# Altium schematic sheet DUT_STM32H753VIT6.SchDoc
size A4; SheetNumber: 1; SheetTotal: 1
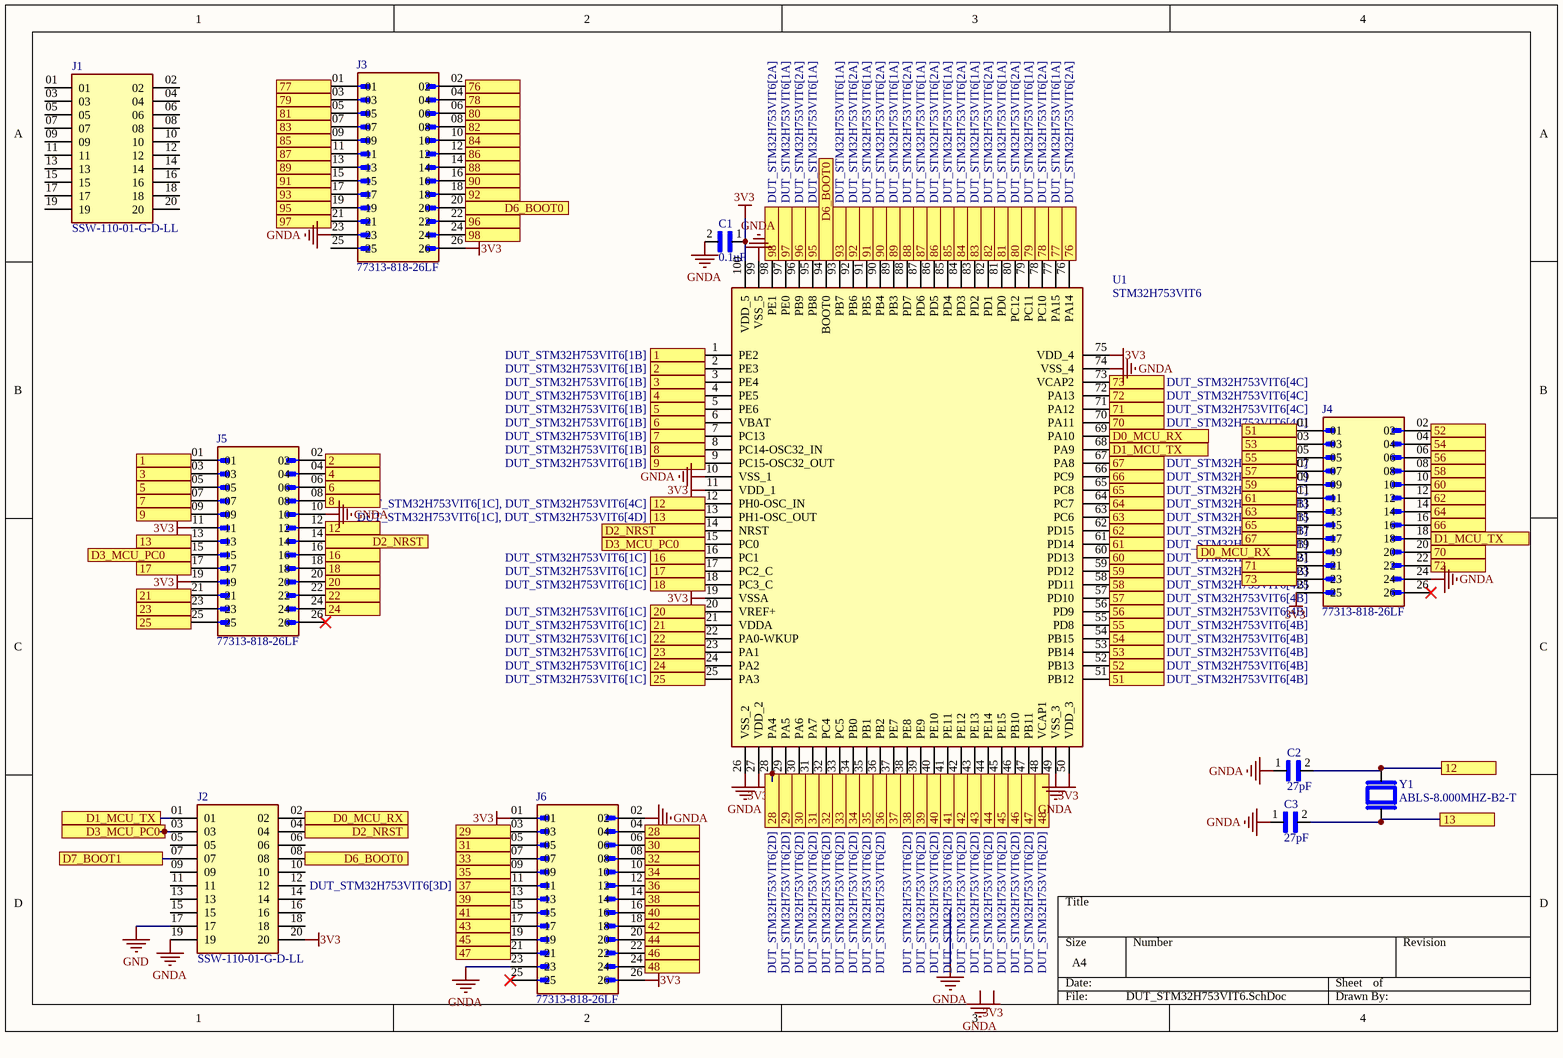
[diagram p0: DUT_STM32H753VIT6.SchDoc]

## Parts
C1  0.1uF  [CAPC1608X90]
C2  27pF  [CAPC1608X90]
C3  27pF  [CAPC1608X90]
J1  SSW-110-01-G-D-LL  [SAMTEC_SSW-110-01-G-D-LL]
J2  SSW-110-01-G-D-LL  [SAMTEC_SSW-110-01-G-D-LL]
J3  77313-818-26LF  [AMPHENOL_77313-818-26LF]
J4  77313-818-26LF  [AMPHENOL_77313-818-26LF]
J5  77313-818-26LF  [AMPHENOL_77313-818-26LF]
J6  77313-818-26LF  [AMPHENOL_77313-818-26LF]
U1  STM32H753VIT6  [QFP50P1600X1600X160-100N]
Y1  ABLS-8.000MHZ-B2-T  [XTAL_ABLS-8.000MHZ-B2-T]

## Ports
1 (see DUT_STM32H753VIT6[1B]), 1 (see DUT_STM32H753VIT6[2B]), 2 (see DUT_STM32H753VIT6[1B]), 2 (see DUT_STM32H753VIT6[2B]), 3 (see DUT_STM32H753VIT6[1B]), 3 (see DUT_STM32H753VIT6[2B]), 4 (see DUT_STM32H753VIT6[1B]), 4 (see DUT_STM32H753VIT6[2B]), 5 (see DUT_STM32H753VIT6[1B]), 5 (see DUT_STM32H753VIT6[2B]), 6 (see DUT_STM32H753VIT6[1B]), 6 (see DUT_STM32H753VIT6[2B]), 7 (see DUT_STM32H753VIT6[1B]), 7 (see DUT_STM32H753VIT6[2B]), 8 (see DUT_STM32H753VIT6[1B]), 8 (see DUT_STM32H753VIT6[2B]), 9 (see DUT_STM32H753VIT6[1B]), 9 (see DUT_STM32H753VIT6[2B]), 12 (see DUT_STM32H753VIT6[1C], DUT_STM32H753VIT6[2B]), 12 (see DUT_STM32H753VIT6[1C], DUT_STM32H753VIT6[4C]), 12 (see DUT_STM32H753VIT6[2B], DUT_STM32H753VIT6[4C]), 13 (see DUT_STM32H753VIT6[1C], DUT_STM32H753VIT6[2B]), 13 (see DUT_STM32H753VIT6[1C], DUT_STM32H753VIT6[4D]), 13 (see DUT_STM32H753VIT6[2B], DUT_STM32H753VIT6[4D]), 16 (see DUT_STM32H753VIT6[1C]), 16 (see DUT_STM32H753VIT6[2C]), 17 (see DUT_STM32H753VIT6[1C]), 17 (see DUT_STM32H753VIT6[2C]), 18 (see DUT_STM32H753VIT6[1C]), 18 (see DUT_STM32H753VIT6[2C]), 20 (see DUT_STM32H753VIT6[1C]), 20 (see DUT_STM32H753VIT6[2C]), 21 (see DUT_STM32H753VIT6[1C]), 21 (see DUT_STM32H753VIT6[2C]), 22 (see DUT_STM32H753VIT6[1C]), 22 (see DUT_STM32H753VIT6[2C]), 23 (see DUT_STM32H753VIT6[1C]), 23 (see DUT_STM32H753VIT6[2C]), 24 (see DUT_STM32H753VIT6[1C]), 24 (see DUT_STM32H753VIT6[2C]), 25 (see DUT_STM32H753VIT6[1C]), 25 (see DUT_STM32H753VIT6[2C]), 28 (see DUT_STM32H753VIT6[2D]), 29 (see DUT_STM32H753VIT6[2D]), 29 (see DUT_STM32H753VIT6[3D]), 30 (see DUT_STM32H753VIT6[2D]), 30 (see DUT_STM32H753VIT6[3D]), 31 (see DUT_STM32H753VIT6[2D]), 31 (see DUT_STM32H753VIT6[3D]), 32 (see DUT_STM32H753VIT6[2D]), 32 (see DUT_STM32H753VIT6[3D]), 33 (see DUT_STM32H753VIT6[2D]), 33 (see DUT_STM32H753VIT6[3D]), 34 (see DUT_STM32H753VIT6[2D]), 34 (see DUT_STM32H753VIT6[3D]), 35 (see DUT_STM32H753VIT6[2D]), 35 (see DUT_STM32H753VIT6[3D]), 36 (see DUT_STM32H753VIT6[2D]), 36 (see DUT_STM32H753VIT6[3D]), 37 (see DUT_STM32H753VIT6[2D]), 37 (see DUT_STM32H753VIT6[3D]), 38 (see DUT_STM32H753VIT6[2D]), 38 (see DUT_STM32H753VIT6[3D]), 39 (see DUT_STM32H753VIT6[2D]), 39 (see DUT_STM32H753VIT6[3D]), 40 (see DUT_STM32H753VIT6[2D]), 40 (see DUT_STM32H753VIT6[3D]), 41 (see DUT_STM32H753VIT6[2D]), 41 (see DUT_STM32H753VIT6[3D]), 42 (see DUT_STM32H753VIT6[2D]), 42 (see DUT_STM32H753VIT6[3D]), 43 (see DUT_STM32H753VIT6[2D]), 43 (see DUT_STM32H753VIT6[3D]), 44 (see DUT_STM32H753VIT6[2D]), 44 (see DUT_STM32H753VIT6[3D]), 45 (see DUT_STM32H753VIT6[2D]), 45 (see DUT_STM32H753VIT6[3D]), 46 (see DUT_STM32H753VIT6[2D]), 46 (see DUT_STM32H753VIT6[3D]), 47 (see DUT_STM32H753VIT6[2D]), 47 (see DUT_STM32H753VIT6[3D]), 48 (see DUT_STM32H753VIT6[2D]), 48 (see DUT_STM32H753VIT6[3D]), 51 (see DUT_STM32H753VIT6[3C]), 51 (see DUT_STM32H753VIT6[4B]), 52 (see DUT_STM32H753VIT6[3C]), 52 (see DUT_STM32H753VIT6[4B]), 53 (see DUT_STM32H753VIT6[3C]), 53 (see DUT_STM32H753VIT6[4B]), 54 (see DUT_STM32H753VIT6[3C]), 54 (see DUT_STM32H753VIT6[4B]), 55 (see DUT_STM32H753VIT6[3C]), 55 (see DUT_STM32H753VIT6[4B]), 56 (see DUT_STM32H753VIT6[3C]), 56 (see DUT_STM32H753VIT6[4B]), 57 (see DUT_STM32H753VIT6[3C]), 57 (see DUT_STM32H753VIT6[4B]), 58 (see DUT_STM32H753VIT6[3C]), 58 (see DUT_STM32H753VIT6[4B]), 59 (see DUT_STM32H753VIT6[3C]), 59 (see DUT_STM32H753VIT6[4B]), 60 (see DUT_STM32H753VIT6[3C]), 60 (see DUT_STM32H753VIT6[4B]), 61 (see DUT_STM32H753VIT6[3C]), 61 (see DUT_STM32H753VIT6[4B]), 62 (see DUT_STM32H753VIT6[3C]), 62 (see DUT_STM32H753VIT6[4B]), 63 (see DUT_STM32H753VIT6[3B]), 63 (see DUT_STM32H753VIT6[4B]), 64 (see DUT_STM32H753VIT6[3B]), 64 (see DUT_STM32H753VIT6[4B]), 65 (see DUT_STM32H753VIT6[3B]), 65 (see DUT_STM32H753VIT6[4C]), 66 (see DUT_STM32H753VIT6[3B]), 66 (see DUT_STM32H753VIT6[4C]), 67 (see DUT_STM32H753VIT6[3B]), 67 (see DUT_STM32H753VIT6[4C]), 70 (see DUT_STM32H753VIT6[3B]), 70 (see DUT_STM32H753VIT6[4C]), 71 (see DUT_STM32H753VIT6[3B]), 71 (see DUT_STM32H753VIT6[4C]), 72 (see DUT_STM32H753VIT6[3B]), 72 (see DUT_STM32H753VIT6[4C]), 73 (see DUT_STM32H753VIT6[3B]), 73 (see DUT_STM32H753VIT6[4C]), 76 (see DUT_STM32H753VIT6[2A]), 76 (see DUT_STM32H753VIT6[3A]), 77 (see DUT_STM32H753VIT6[1A]), 77 (see DUT_STM32H753VIT6[3A]), 78 (see DUT_STM32H753VIT6[2A]), 78 (see DUT_STM32H753VIT6[3A]), 79 (see DUT_STM32H753VIT6[1A]), 79 (see DUT_STM32H753VIT6[3A]), 80 (see DUT_STM32H753VIT6[2A]), 80 (see DUT_STM32H753VIT6[3A]), 81 (see DUT_STM32H753VIT6[1A]), 81 (see DUT_STM32H753VIT6[3A]), 82 (see DUT_STM32H753VIT6[2A]), 82 (see DUT_STM32H753VIT6[3A]), 83 (see DUT_STM32H753VIT6[1A]), 83 (see DUT_STM32H753VIT6[3A]), 84 (see DUT_STM32H753VIT6[2A]), 84 (see DUT_STM32H753VIT6[3A]), 85 (see DUT_STM32H753VIT6[1A]), 85 (see DUT_STM32H753VIT6[3A]), 86 (see DUT_STM32H753VIT6[2A]), 86 (see DUT_STM32H753VIT6[3A]), 87 (see DUT_STM32H753VIT6[1A]), 87 (see DUT_STM32H753VIT6[3A]), 88 (see DUT_STM32H753VIT6[2A]), 88 (see DUT_STM32H753VIT6[3A]), 89 (see DUT_STM32H753VIT6[1A]), 89 (see DUT_STM32H753VIT6[3A]), 90 (see DUT_STM32H753VIT6[2A]), 90 (see DUT_STM32H753VIT6[3A]), 91 (see DUT_STM32H753VIT6[1A]), 91 (see DUT_STM32H753VIT6[3A]), 92 (see DUT_STM32H753VIT6[2A]), 92 (see DUT_STM32H753VIT6[3A]), 93 (see DUT_STM32H753VIT6[1A]), 93 (see DUT_STM32H753VIT6[3A]), 95 (see DUT_STM32H753VIT6[1A]), 95 (see DUT_STM32H753VIT6[3A]), 96 (see DUT_STM32H753VIT6[2A]), 96 (see DUT_STM32H753VIT6[3A]), 97 (see DUT_STM32H753VIT6[1A]), 97 (see DUT_STM32H753VIT6[3A]), 98 (see DUT_STM32H753VIT6[2A]), D0_MCU_RX (see DUT_STM32H753VIT6[1D], DUT_STM32H753VIT6[3B]), D0_MCU_RX (see DUT_STM32H753VIT6[1D], DUT_STM32H753VIT6[4C]), D0_MCU_RX (see DUT_STM32H753VIT6[3B], DUT_STM32H753VIT6[4C]), D1_MCU_TX (see DUT_STM32H753VIT6[1D], DUT_STM32H753VIT6[3B]), D1_MCU_TX (see DUT_STM32H753VIT6[1D], DUT_STM32H753VIT6[4C]), D1_MCU_TX (see DUT_STM32H753VIT6[3B], DUT_STM32H753VIT6[4C]), D2_NRST (see DUT_STM32H753VIT6[1C], DUT_STM32H753VIT6[1D]), D2_NRST (see DUT_STM32H753VIT6[1C], DUT_STM32H753VIT6[2C]), D2_NRST (see DUT_STM32H753VIT6[1D], DUT_STM32H753VIT6[2C]), D3_MCU_PC0 (see DUT_STM32H753VIT6[1C], DUT_STM32H753VIT6[1D]), D3_MCU_PC0 (see DUT_STM32H753VIT6[1C], DUT_STM32H753VIT6[2C]), D3_MCU_PC0 (see DUT_STM32H753VIT6[1D], DUT_STM32H753VIT6[2C]), D6_BOOT0 (see DUT_STM32H753VIT6[1D], DUT_STM32H753VIT6[2A]), D6_BOOT0 (see DUT_STM32H753VIT6[1D], DUT_STM32H753VIT6[3A]), D6_BOOT0 (see DUT_STM32H753VIT6[2A], DUT_STM32H753VIT6[3A]), D7_BOOT1

## Nets
3V3: C1.1 J2.20 J3.26 J4.25 J5.11 J5.19 J6.01 J6.26 U1.11(VDD_1) U1.19(VSSA) U1.27(VDD_2) U1.50(VDD_3) U1.75(VDD_4) U1.100(VDD_5)
GND: J2.17
GNDA: C1.2 C2.1 C3.1 J2.19 J3.23 J4.24 J5.10 J6.02 J6.23 U1.10(VSS_1) U1.26(VSS_2) U1.49(VSS_3) U1.74(VSS_4) U1.99(VSS_5)
1: J5.01 U1.1(PE2) ; port 1
2: J5.02 U1.2(PE3) ; port 2
3: J5.03 U1.3(PE4) ; port 3
4: J5.04 U1.4(PE5) ; port 4
5: J5.05 U1.5(PE6) ; port 5
6: J5.06 U1.6(VBAT) ; port 6
7: J5.07 U1.7(PC13) ; port 7
8: J5.08 U1.8(PC14-OSC32_IN) ; port 8
9: J5.09 U1.9(PC15-OSC32_OUT) ; port 9
12: C2.2 J5.12 U1.12(PH0-OSC_IN) Y1.1 ; port 12
13: C3.2 J5.13 U1.13(PH1-OSC_OUT) Y1.2 ; port 13
16: J5.16 U1.16(PC1) ; port 16
17: J5.17 U1.17(PC2_C) ; port 17
18: J5.18 U1.18(PC3_C) ; port 18
20: J5.20 U1.20(VREF+) ; port 20
21: J5.21 U1.21(VDDA) ; port 21
22: J5.22 U1.22(PA0-WKUP) ; port 22
23: J5.23 U1.23(PA1) ; port 23
24: J5.24 U1.24(PA2) ; port 24
25: J5.25 U1.25(PA3) ; port 25
28: J6.04 U1.28(PA4) ; port 28
29: J6.03 U1.29(PA5) ; port 29
30: J6.06 U1.30(PA6) ; port 30
31: J6.05 U1.31(PA7) ; port 31
32: J6.08 U1.32(PC4) ; port 32
33: J6.07 U1.33(PC5) ; port 33
34: J6.10 U1.34(PB0) ; port 34
35: J6.09 U1.35(PB1) ; port 35
36: J6.12 U1.36(PB2) ; port 36
37: J6.11 U1.37(PE7) ; port 37
38: J6.14 U1.38(PE8) ; port 38
39: J6.13 U1.39(PE9) ; port 39
40: J6.16 U1.40(PE10) ; port 40
41: J6.15 U1.41(PE11) ; port 41
42: J6.18 U1.42(PE12) ; port 42
43: J6.17 U1.43(PE13) ; port 43
44: J6.20 U1.44(PE14) ; port 44
45: J6.19 U1.45(PE15) ; port 45
46: J6.22 U1.46(PB10) ; port 46
47: J6.21 U1.47(PB11) ; port 47
48: J6.24 U1.48(VCAP1) ; port 48
51: J4.01 U1.51(PB12) ; port 51
52: J4.02 U1.52(PB13) ; port 52
53: J4.03 U1.53(PB14) ; port 53
54: J4.04 U1.54(PB15) ; port 54
55: J4.05 U1.55(PD8) ; port 55
56: J4.06 U1.56(PD9) ; port 56
57: J4.07 U1.57(PD10) ; port 57
58: J4.08 U1.58(PD11) ; port 58
59: J4.09 U1.59(PD12) ; port 59
60: J4.10 U1.60(PD13) ; port 60
61: J4.11 U1.61(PD14) ; port 61
62: J4.12 U1.62(PD15) ; port 62
63: J4.13 U1.63(PC6) ; port 63
64: J4.14 U1.64(PC7) ; port 64
65: J4.15 U1.65(PC8) ; port 65
66: J4.16 U1.66(PC9) ; port 66
67: J4.17 U1.67(PA8) ; port 67
70: J4.20 U1.70(PA11) ; port 70
71: J4.21 U1.71(PA12) ; port 71
72: J4.22 U1.72(PA13) ; port 72
73: J4.23 U1.73(VCAP2) ; port 73
76: J3.02 U1.76(PA14) ; port 76
77: J3.01 U1.77(PA15) ; port 77
78: J3.04 U1.78(PC10) ; port 78
79: J3.03 U1.79(PC11) ; port 79
80: J3.06 U1.80(PC12) ; port 80
81: J3.05 U1.81(PD0) ; port 81
82: J3.08 U1.82(PD1) ; port 82
83: J3.07 U1.83(PD2) ; port 83
84: J3.10 U1.84(PD3) ; port 84
85: J3.09 U1.85(PD4) ; port 85
86: J3.12 U1.86(PD5) ; port 86
87: J3.11 U1.87(PD6) ; port 87
88: J3.14 U1.88(PD7) ; port 88
89: J3.13 U1.89(PB3) ; port 89
90: J3.16 U1.90(PB4) ; port 90
91: J3.15 U1.91(PB5) ; port 91
92: J3.18 U1.92(PB6) ; port 92
93: J3.17 U1.93(PB7) ; port 93
95: J3.19 U1.95(PB8) ; port 95
96: J3.22 U1.96(PB9) ; port 96
97: J3.21 U1.97(PE0) ; port 97
98: J3.24 U1.98(PE1) ; port 98
D0_MCU_RX: J2.02 J4.19 U1.69(PA10) ; port D0_MCU_RX
D1_MCU_TX: J2.01 J4.18 U1.68(PA9) ; port D1_MCU_TX
D2_NRST: J2.04 J5.14 U1.14(NRST) ; port D2_NRST
D3_MCU_PC0: J2.03 J5.15 U1.15(PC0) ; port D3_MCU_PC0
D6_BOOT0: J2.08 J3.20 U1.94(BOOT0) ; port D6_BOOT0
D7_BOOT1: J2.07 ; port D7_BOOT1

Not connected (* = marked no-connect by the designer): J1 01 02 03 04 05 06 07 08 09 10 11 12 13 14 15 16 17 18 19 20; J2 05 06 09 10 11 12 13 14 15 16 18; J3 25; J4 26*; J5 26*; J6 25*

## Notes on the sheet
- Labels drawn without touching a wire or pin: 3V3, GNDA

## Library data of the parts
C1 = CC0603MRX5R7BB106: CAP CER 10UF 16V X5R 0603; Package: None; Price: None; Value: *; MP: CC0603MRX5R7BB106; Availability: Unavailable
C2 C3 = CC0603MRX5R7BB106: 0603; Package: None; Price: None; Value: *; MP: CC0603MRX5R7BB106; Availability: Unavailable
J1 J2 = SSW-110-01-G-D-LL: MF: Samtec Inc.; Value: *; Availability: Unavailable; Package: None; Price: None; MP: SSW-110-01-G-D-LL
J3-J6 = 77313-818-26LF: BergStik, Board to Board connector, Unshrouded Header, 2.54 mm Pitch, Vertical, Double Row,Through Hole, 26 Positions; MF: Amphenol ICC (FCI); SnapEDA_Link: https://www.snapeda.com/parts/77313-818-26LF/Amphenol+FCI/view-part/?ref=snap; Package: None; Value: *; MP: 77313-818-26LF; Check_prices: https://www.snapeda.com/parts/77313-818-26LF/Amphenol+FCI/view-part/?ref=eda
U1 = STM32H753VIT6: ARM Microcontrollers - MCU High-performance and DSP with DP-FPU, ARM Cortex-M7 MCU with 2MBytes Flash, 1MB RAM, 400 MHz CPU, Art Accelerator, L1 cache, external memory interface, large set of peripherals including a Crypto accelerator; Manufacturer_Name: STMicroelectronics; Geometry.Height: 1.6mm; Mouser Part Number: 511-STM32H753VIT6; Mouser Price/Stock: https://www.mouser.co.uk/ProductDetail/STMicroelectronics/STM32H753VIT6?qs=u4fy%2FsgLU9OfOK8gAGKF5w%3D%3D; Manufacturer_Part_Number: STM32H753VIT6; Datasheet Link: https://www.st.com/resource/en/datasheet/stm32h753vi.pdf
Y1 = ABLS-8.000MHZ-B2-T: HC/49US (AT49) SMD LOW PROFILE CRYSTAL; MF: Abracon LLC; Availability: In Stock; Purchase-URL: https://pricing.snapeda.com/search/part/ABLS-8.000MHZ-B2-T/?ref=eda; Package: HC49/US Abracon; MP: ABLS-8.000MHZ-B2-T; Value: *; Check_prices: https://www.snapeda.com/parts/ABLS-8.000MHZ-B2-T/Abracon+LLC/view-part/?ref=eda; SnapEDA_Link: https://www.snapeda.com/parts/ABLS-8.000MHZ-B2-T/Abracon+LLC/view-part/?ref=snap; Price: None